# Altium project pcb1.PrjPcb
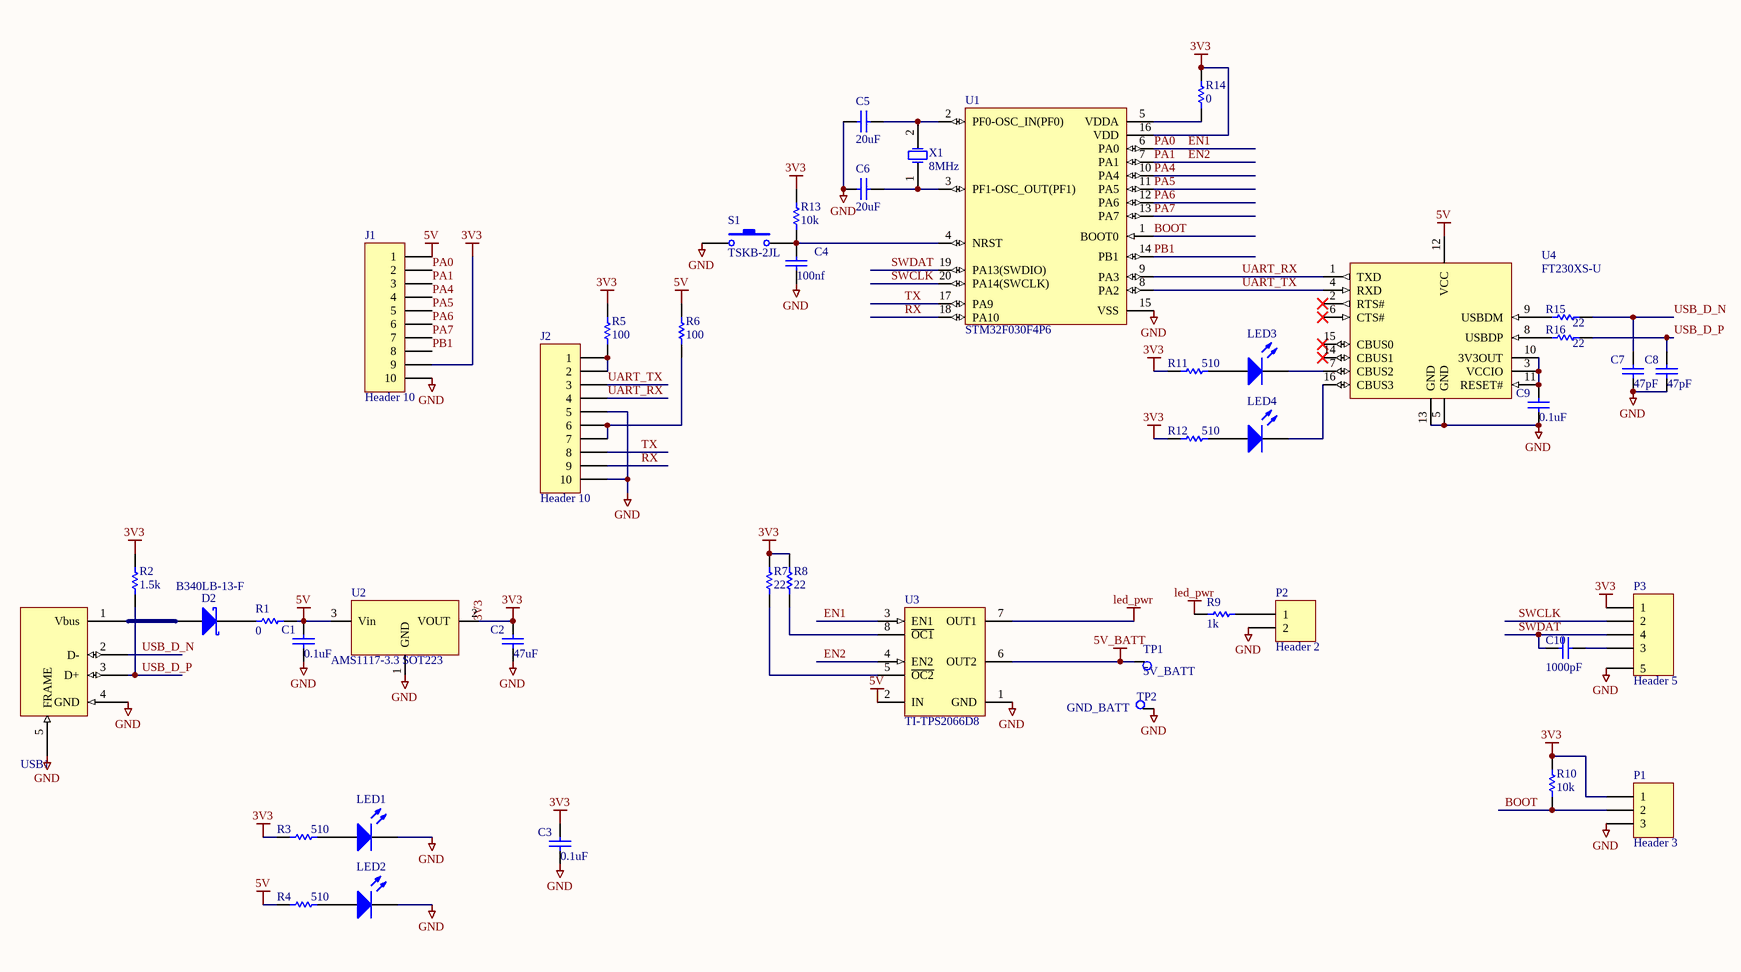
[diagram p0: 5v_led_charger.SchDoc]
1 sheet, 45 parts. Net scope: global (net labels, ports and power ports of the same name join across sheets).
Board files: PCB.PcbDoc, PCB_led.PcbDoc

## Sheet 5v_led_charger.SchDoc
size A3; CompanyName: 瀬沼電子; Organization: 瀬沼電子; Address1: 〒197-0827; Address2: 東京都あきる野; Address3: 油平259; Phone: 042-558-0141; Rule: PcbType=ProtelPcb

### Parts
C1  0.1uF  [1608[0603]]
C2  47uF  [1608[0603]]
C3  0.1uF  [1608[0603]]
C4  100nf  [1608[0603]]
C5  20uF  [1608[0603]]
C6  20uF  [1608[0603]]
C7  47pF  [1608[0603]]
C8  47pF  [1608[0603]]
C9  0.1uF  [1608[0603]]
C10  1000pF  [1608[0603]]
D2  B340LB-13-F  [DIOM4336X25N]
J1  Header 10  [HDR1X10]
J2  Header 10  [HDR1X10]
LED1  LED2  [KING-0603LED_YELLOW_V]  (value not drawn)
LED2  LED2  [KING-0603LED_GREEN_V]  (value not drawn)
LED3  LED2  [KING-0603LED_GREEN_V]  (value not drawn)
LED4  LED2  [KING-0603LED_ORANGE_V]  (value not drawn)
P1  Header 3  [HDR1X3]
P2  Header 2  [HDR1X2]
P3  Header 5  [HDR1X5]
R1  0  [1608[0603]]
R2  1.5k  [1608[0603]]
R3  510  [1608[0603]]
R4  510  [1608[0603]]
R5  100  [1608[0603]]
R6  100  [1608[0603]]
R7  22  [1608[0603]]
R8  22  [1608[0603]]
R9  1k  [1608[0603]]
R10  10k  [1608[0603]]
R11  510  [1608[0603]]
R12  510  [1608[0603]]
R13  10k  [1608[0603]]
R14  0  [1608[0603]]
R15  22  [1608[0603]]
R16  22  [1608[0603]]
S1  TSKB-2JL  [TSKB-2JL]
TP1  5V_BATT  [PAD1]
TP2  GND_BATT  [PAD1]
U1  STM32F030F4P6  [STM-TSSOP20_L]
U2  AMS1117-3.3 SOT223  [SOT223_L]
U3  TI-TPS2066D8  [D8_L]
U4  FT230XS-U  [SSOP-16_L]
USB1  USB002  [USB/SM0.8-6H5]  (value not drawn)
X1  8MHz  [ABRA-ABLS2-2_V]

### Nets
3V3: C2.2 C3.2 J1.9 P1.1 P3.1 R2.1 R3.2 R5.1 R7.1 R8.1 R10.2 R11.2 R12.2 R13.1 R14.1 U1.16(VDD) U2.2(VOUT)
5V: C1.2 J1.1 R1.1 R4.2 R6.1 U2.3(Vin) U3.2(IN) U4.12(VCC)
5V_BATT: TP1.1 U3.6(OUT2)
GND: C1.1 C2.1 C3.1 C4.1 C5.2 C6.2 C7.1 C8.1 C9.1 J1.10 J2.5 J2.10 LED1.2(K) LED2.2(K) P1.3 P2.2 P3.5 S1.1 TP2.1 U1.15(VSS) U2.1(GND) U3.1(GND) U4.5(GND) U4.13(GND) USB1.4(GND) USB1.5(FRAME)
led_pwr: R9.1 U3.7(OUT1)
BOOT: P1.2 R10.1 U1.1(BOOT0)
EN1: J1.2 U1.6(PA0) U3.3(EN1)  [also labelled PA0]
EN2: J1.3 U1.7(PA1) U3.4(EN2)  [also labelled PA1]
PA4: J1.4 U1.10(PA4)
PA5: J1.5 U1.11(PA5)
PA6: J1.6 U1.12(PA6)
PA7: J1.7 U1.13(PA7)
PB1: J1.8 U1.14(PB1)
RX: J2.9 U1.18(PA10)
SWCLK: P3.2 U1.20(PA14(SWCLK))
SWDAT: C10.1 P3.4 U1.19(PA13(SWDIO))
TX: J2.8 U1.17(PA9)
UART_RX: J2.4 U1.9(PA3) U4.1(TXD)
UART_TX: J2.3 U1.8(PA2) U4.4(RXD)
USB_D_N: C7.2 R15.1 USB1.2(D-)
USB_D_P: C8.2 R2.2 R16.1 USB1.3(D+)
NetC4_2: C4.2 R13.2 S1.2 U1.4(NRST)
NetC5_1: C5.1 U1.2(PF0-OSC_IN(PF0)) X1.2(X2)
NetC6_1: C6.1 U1.3(PF1-OSC_OUT(PF1)) X1.1(X1)
NetC9_2: C9.2 U4.3(VCCIO) U4.10(3V3OUT) U4.11(RESET#)
NetC10_2: C10.2 P3.3
NetD2_1: D2.1(A) USB1.1(Vbus)
NetD2_2: D2.2(K) R1.2
NetJ2_1: J2.1 J2.2 R5.2
NetJ2_6: J2.6 J2.7 R6.2
NetLED1_1: LED1.1(A) R3.1
NetLED2_1: LED2.1(A) R4.1
NetLED3_1: LED3.1(A) R11.1
NetLED3_2: LED3.2(K) U4.7(CBUS2)
NetLED4_1: LED4.1(A) R12.1
NetLED4_2: LED4.2(K) U4.16(CBUS3)
NetP2_1: P2.1 R9.2
NetR7_2: R7.2 U3.5(~{OC2})
NetR8_2: R8.2 U3.8(~{OC1})
NetR14_2: R14.2 U1.5(VDDA)
NetR15_2: R15.2 U4.9(USBDM)
NetR16_2: R16.2 U4.8(USBDP)

Not connected (* = marked no-connect by the designer): U4 2(RTS#)* 6(CTS#)* 14(CBUS1)* 15(CBUS0)*

### Notes on the sheet
- Title:
- A3
- Designer:
- Company:
- Revisions:
- Notes:
- Dept.:
- Email:
- File:
- rev:
- sheet:
- of
- Marked:

### Library data of the parts
C1-C10 = Cap: Capacitor; Published: 8-Jun-2000; LatestRevisionDate: 17-Jul-2002; LatestRevisionNote: Re-released for DXP Platform.; PackageReference: RAD-0.3; Publisher: Altium Limited; PackageDescription: Radial Cap, Thru-Hole; 2 Leads; 0.3 in Pin Spacing
  C1 C3 C9: Value: 0.1uF
  C2: Value: 47uF
  C4: Value: 100nf
  C5 C6: Value: 20uF
  C7 C8: Value: 47pF
  C10: Value: 1000pF
D2 = D Schottky: Schottky Diode; OTHER: SX34F @20; LatestRevisionDate: 17-Jul-2002; LatestRevisionNote: Re-released for DXP Platform.; PackageReference: SMB; Publisher: Altium Limited; Code_JEDEC: DO-214-AA
J1 J2 = Header 10: Header, 10-Pin; LatestRevisionDate: 17-Jul-2002; LatestRevisionNote: Re-released for DXP Platform.; Publisher: Altium Limited
LED1-LED4 = LED2: Typical RED, GREEN, YELLOW, AMBER GaAs LED; Published: 8-Jun-2000; LatestRevisionDate: 17-Jul-2002; LatestRevisionNote: Re-released for DXP Platform.; PackageVersion: Feb-2002; PackageReference: 3.2X1.6X1.1; Publisher: Altium Limited; PackageDescription: SM LED; 2 Flat Leads
P1 = Header 3: Header, 3-Pin; LatestRevisionDate: 17-Jul-2002; LatestRevisionNote: Re-released for DXP Platform.; Publisher: Altium Limited
P2 = Header 2: Header, 2-Pin; LatestRevisionDate: 17-Jul-2002; LatestRevisionNote: Re-released for DXP Platform.; Publisher: Altium Limited
P3 = Header 5: Header, 5-Pin; LatestRevisionDate: 17-Jul-2002; LatestRevisionNote: Re-released for DXP Platform.; Publisher: Altium Limited
R1-R16 = Res1: Resistor; PARTS: AH-50W 10R; PRICE: 350; LatestRevisionDate: 17-Jul-2002; LatestRevisionNote: Re-released for DXP Platform.; PackageReference: AXIAL-0.3
  R1 R14: Value: 0
  R2: Value: 1.5k
  R3 R4 R11 R12: Value: 510
  R5 R6: Value: 100
  R7 R8 R15 R16: Value: 22
  R9: Value: 1k
  R10 R13: Value: 10k
S1 = SW-PB: Switch; Published: 24-Mar-1999; LatestRevisionDate: 17-Jul-2002; LatestRevisionNote: Re-released for DXP Platform.; PackageReference: SPST-2; Publisher: Altium Limited; PackageDescription: Switch; 2 Leads
TP1 TP2 = RAUND1
U1 = CMP-0304-00039-2: ARM Cortex-M0 32-bit MCU, 16 KB Flash, 4 KB Internal RAM, 15 I/Os, 20-pin TSSOP, -40 to 85 degC, Tube; I/Os (High Current): 15; FLASH Size (Prog) (kB): 16; Internal RAM Size (kB): 4; Supply Voltage(Vcc) min (V): 2.4; Operating Frequency(F) (Processor speed) (MHz): 48; ComponentLink2URL: http://www.st.com/st-web-ui/static/active/en/resource/technical/document/datasheet/DM00088500.pdf; Core: ARM Cortex-M0; ComponentLink2Description: Datasheet; PackageDescription: 20-Pin Thin Shrink Small Outline Package, 6.5 x 4.4 mm Body, 0.65 mm Pitch; Mounting Technology: Surface Mount; ComponentLink1URL: http://www.st.com/web/en/home.html; PackageVersion: Rev. 1, 11/2012; ComponentLink3Description: Package Specification; PartNumber: STM32F030F4P6; ComponentLink3URL: http://www.st.com/st-web-ui/static/active/en/resource/technical/document/datasheet/DM00065136.pdf; DatasheetVersion: Rev. 1; PackageReference: TSSOP20; ComponentLink1Description: Manufacturer URL; Packing: Tube
U2 = AMS1117-3.3
U4 = CMP-0248-00025-2: USB to Basic UART Interface Chip, UHCI/OHCI/EHCI Compatible, USB 2.0 Compatible, -40 to +85 degC, 16-Pin SSOP, Pb-Free, Tube; Manufacturer: FTDI; PackageDescription: 16-Pin Small Outline Package, 8.6 x 3.9 mm Body, 0.635 mm Pitch; ComponentLink2URL: http://www.ftdichip.com/Support/Documents/DataSheets/ICs/DS_FT230X.pdf; ComponentLink3URL: www.ftdichip.com/Products/ICs/FT230X.html; PartNumber: FT230XS-U; RevisionNote: DatasheetVersion updated to 1.2 Feb-2013; PackageVersion: Feb-13; ComponentLink2Description: Datasheet; Code_JEDEC: MO-137-AB; DatasheetVersion: ver 1.2, Feb-2013; ComponentLink1URL: http://www.ftdichip.com/; PackageReference: SSOP-16; ComponentLink1Description: Manufacturer URL; ComponentLink3Description: FT230X Product Page
X1 = CMP-0277-00002-1: Low Profile Surface Mount Microprocessor Crystal, 4.096 MHz +/-30 ppm, 180 Ohm, -40 to 85 degC, 2-Pin 11.4 x 4.7 x 3.3 mm SMD, RoHS, Tape and Reel; Manufacturer: Abracon; PartNumber: ABLS2-4.096MHZ-D4Y-T; Operation Mode: Fundamental or 3rd Overtone; Shunt Capacitance: 7 pF Max.; ESR: 180 Ohm; Load Capacitance: 18 pF; Mounting Technology: Surface Mount; PackageDescription: 2-Pin SMD, Body 11.4 x 4.7 mm, Height 3.3 mm; ComponentLink1URL: http://www.abracon.com/; Freq. Stability: +/- 30 ppm; ComponentLink2Description: Datasheet; Operating Temp. Range: -40 to 85 degC; Packing: Tape and Reel; RoHS: TRUE; PackageReference: ABLS2-2; DatasheetVersion: Rev. 03.31.11; Freq. Tolerance: +/- 30 ppm; Frequency: 8MHz; ComponentLink2URL: http://www.abracon.com/Resonators/ABLS2.pdf; ComponentLink1Description: Manufacturer URL